# Altium schematic sheet 02_MCU.SchDoc: Temperature Logger
size A3; Organization: UnboxNbeyond; DocumentNumber: 2; Revision: A1; SheetNumber: 2; SheetTotal: 2
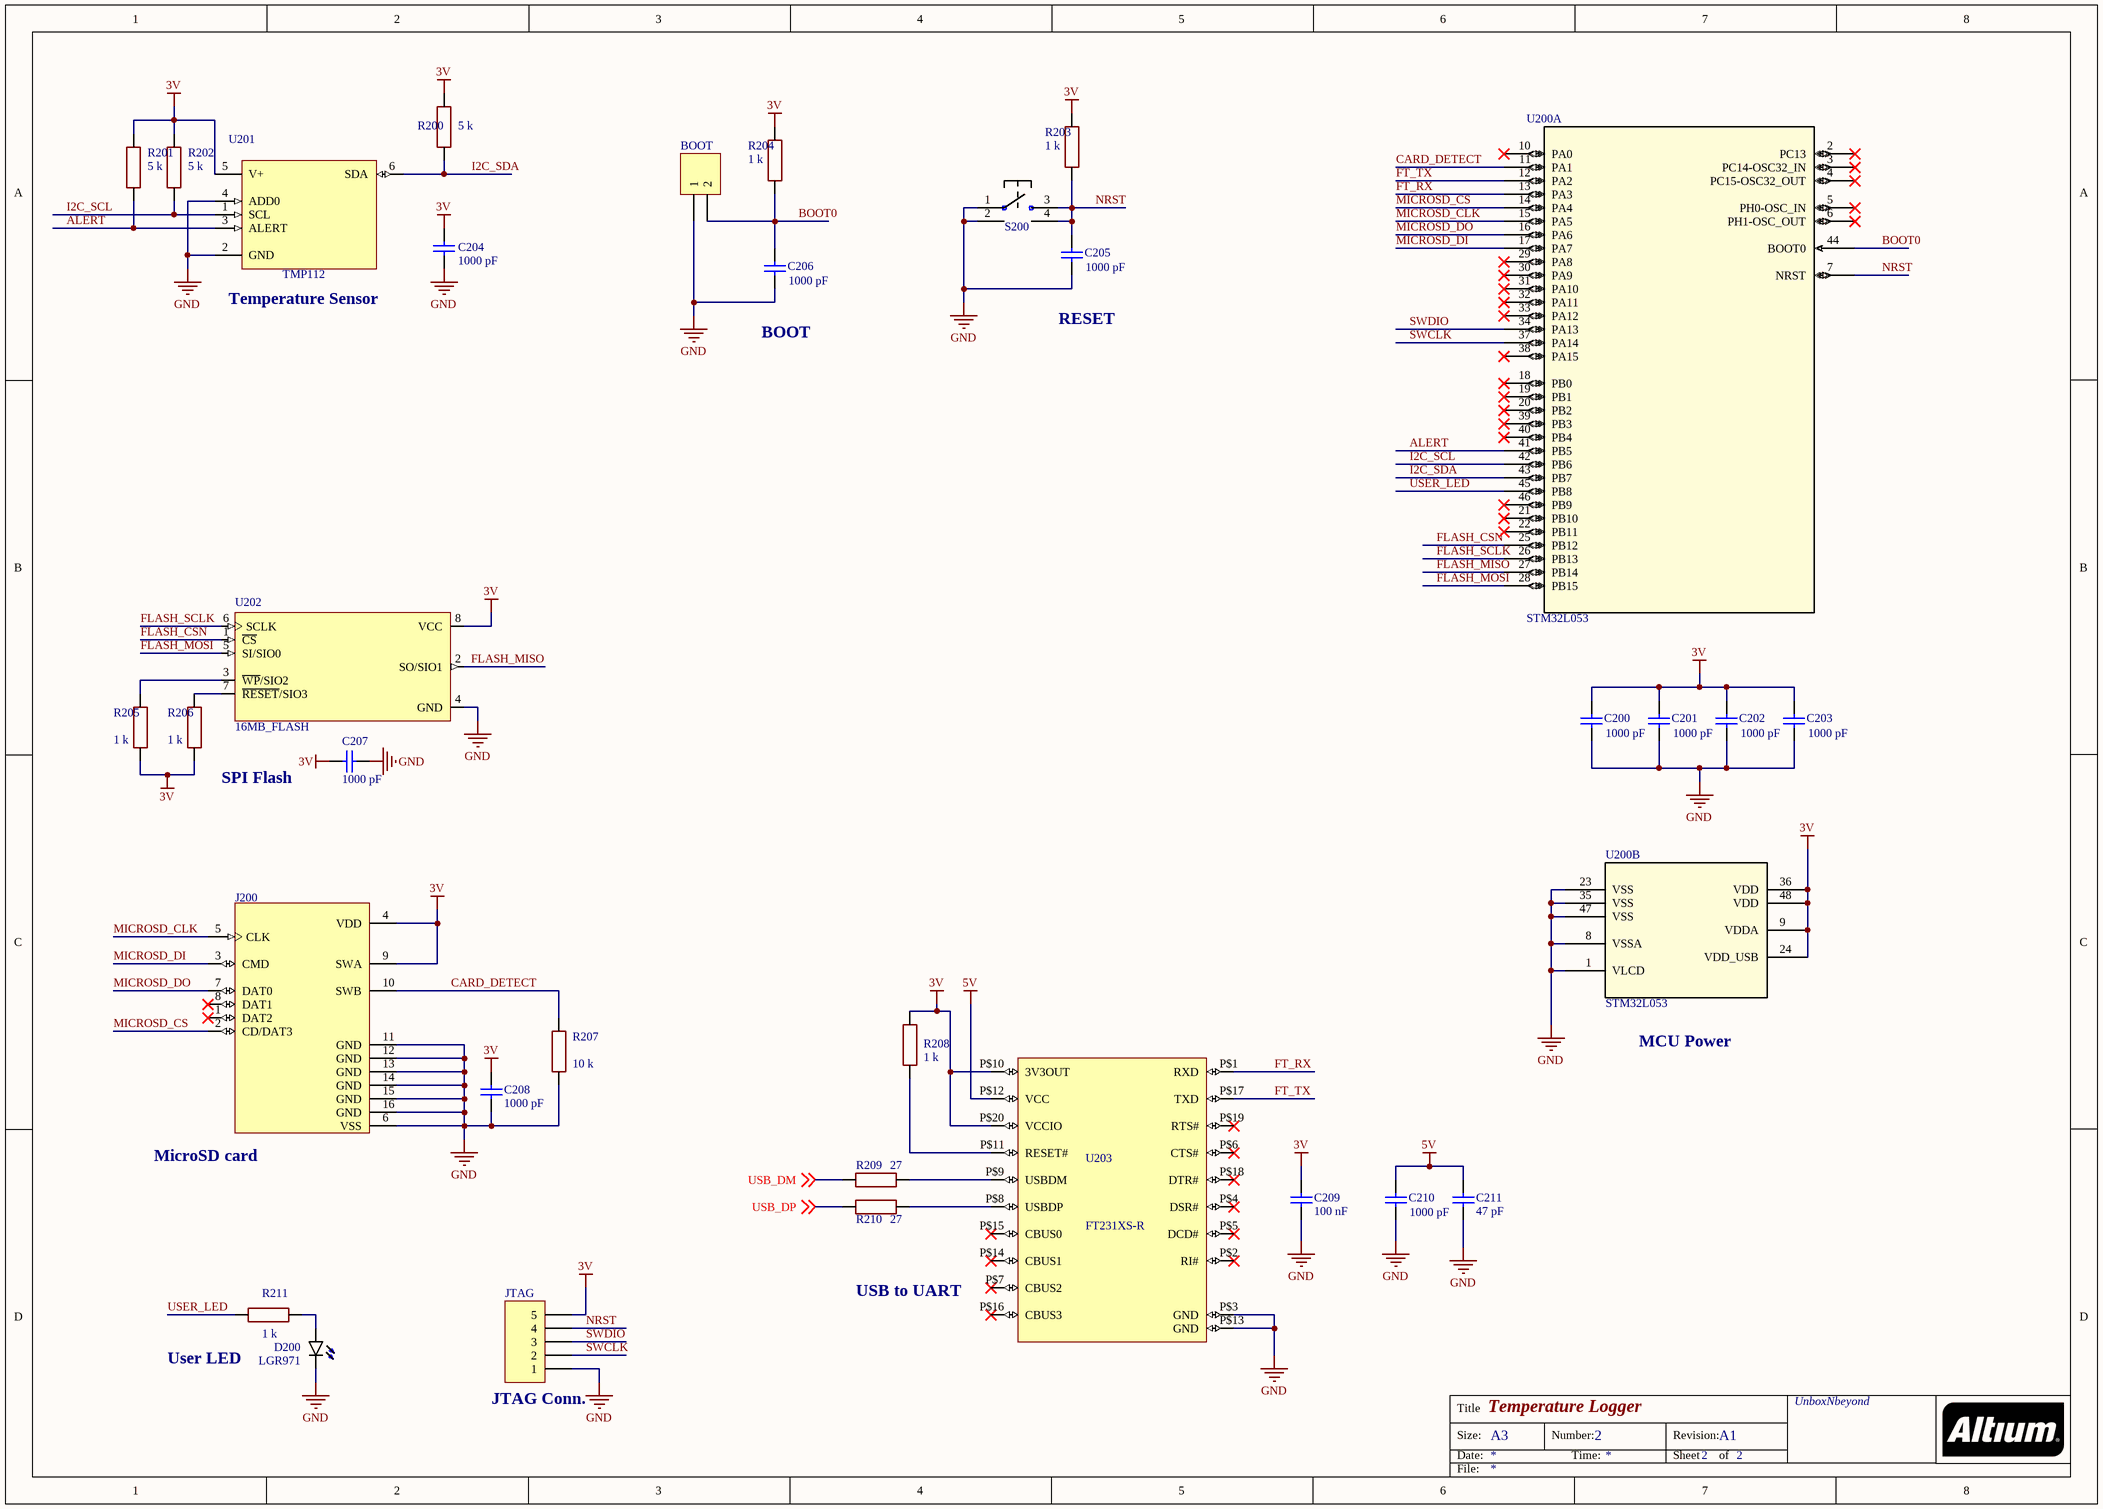
[diagram p0: 02_MCU.SchDoc]

## Parts
BOOT  (no value)  [HDR1X2]
C200  1000 pF  [C0805]
C201  1000 pF  [C0805]
C202  1000 pF  [C0805]
C203  1000 pF  [C0805]
C204  1000 pF  [C0805]
C205  1000 pF  [C0805]
C206  1000 pF  [C0805]
C207  1000 pF  [C0805]
C208  1000 pF  [C0805]
C209  100 nF  [C0805]
C210  1000 pF  [C0805]
C211  47 pF  [C0805]
D200  LGR971  [D0805]
J200  MicroSD  [MicroSD]  (value not drawn)
JTAG  (no value)  [HDR1X5]
R200  5 k  [R0805]
R201  5 k  [R0805]
R202  5 k  [R0805]
R203  1 k  [R0805]
R204  1 k  [R0805]
R205  1 k  [R0805]
R206  1 k  [R0805]
R207  10 k  [R0805]
R208  1 k  [R0805]
R209  27  [R0805]
R210  27  [R0805]
R211  1 k  [R0805]
S200  Switch_tactile  [Tactile1]  (value not drawn)
U200  STM32L053  [LQFP48-7x7mm]  (parts A,B of 2)
U201  TMP112  [SOT563]
U202  16MB_FLASH  [8-SOIC]
U203  FT231XS-R  [SSOP20]

## Nets
3V: C200.2 C201.2 C202.2 C203.2 C204.2 C207.2 C208.1 C209.2 J200.4(VDD) J200.9(SWA) JTAG.5 R200.1 R201.1 R202.1 R203.1 R204.1 R205.1 R206.1 R208.1 U200.9(VDDA) U200.24(VDD_USB) U200.36(VDD) U200.48(VDD) U201.5(V+) U202.8(VCC) U203.P$10(3V3OUT) U203.P$20(VCCIO)
5V: C210.2 C211.2 U203.P$12(VCC)
GND: BOOT.1 C200.1 C201.1 C202.1 C203.1 C204.1 C205.1 C206.1 C207.1 C208.2 C209.1 C210.1 C211.1 D200.C J200.6(VSS) J200.11(GND) J200.12(GND) J200.13(GND) J200.14(GND) J200.15(GND) J200.16(GND) JTAG.1 R207.2 S200.1(P$1) S200.2(P$1) U200.1(VLCD) U200.8(VSSA) U200.23(VSS) U200.35(VSS) U200.47(VSS) U201.2(GND) U201.4(ADD0) U202.4(GND) U203.P$3(GND) U203.P$13(GND)
ALERT: R201.2 U200.41(PB5) U201.3(ALERT)
BOOT0: BOOT.2 C206.2 R204.2 U200.44(BOOT0)
CARD_DETECT: J200.10(SWB) R207.1 U200.11(PA1)
FLASH_CSN: U200.25(PB12) U202.1(~{CS})
FLASH_MISO: U200.27(PB14) U202.2(SO/SIO1)
FLASH_MOSI: U200.28(PB15) U202.5(SI/SIO0)
FLASH_SCLK: U200.26(PB13) U202.6(SCLK)
FT_RX: U200.13(PA3) U203.P$1(RXD)
FT_TX: U200.12(PA2) U203.P$17(TXD)
I2C_SCL: R202.2 U200.42(PB6) U201.1(SCL)
I2C_SDA: R200.2 U200.43(PB7) U201.6(SDA)
MICROSD_CLK: J200.5(CLK) U200.15(PA5)
MICROSD_CS: J200.2(CD/DAT3) U200.14(PA4)
MICROSD_DI: J200.3(CMD) U200.17(PA7)
MICROSD_DO: J200.7(DAT0) U200.16(PA6)
NRST: C205.2 JTAG.4 R203.2 S200.3(P$2) S200.4(P$2) U200.7(NRST)
SWCLK: JTAG.2 U200.37(PA14)
SWDIO: JTAG.3 U200.34(PA13)
USB_DM: R209.2 ; off-sheet USB_DM
USB_DP: R210.2 ; off-sheet USB_DP
USER_LED: R211.2 U200.45(PB8)
NetD200_A: D200.A R211.1
NetR205_2: R205.2 U202.3(~{WP}/SIO2)
NetR206_2: R206.2 U202.7(~{RESET}/SIO3)
NetR208_2: R208.2 U203.P$11(RESET#)
NetR209_1: R209.1 U203.P$9(USBDM)
NetR210_1: R210.1 U203.P$8(USBDP)

Not connected (* = marked no-connect by the designer): J200 1(DAT2)* 8(DAT1)*; U200 2(PC13)* 3(PC14-OSC32_IN)* 4(PC15-OSC32_OUT)* 5(PH0-OSC_IN)* 6(PH1-OSC_OUT)* 10(PA0)* 18(PB0)* 19(PB1)* 20(PB2)* 21(PB10)* 22(PB11)* 29(PA8)* 30(PA9)* 31(PA10)* 32(PA11)* 33(PA12)* 38(PA15)* 39(PB3)* 40(PB4)* 46(PB9)*; U203 P$2(RI#)* P$4(DSR#)* P$5(DCD#)* P$6(CTS#)* P$7(CBUS2)* P$14(CBUS1)* P$15(CBUS0)* P$16(CBUS3)* P$18(DTR#)* P$19(RTS#)*

## Notes on the sheet
- (near U201) Temperature Sensor
- (near C206) BOOT
- (near C205) RESET
- SPI Flash
- MCU Power
- (near J200) MicroSD card
- USB to UART
- (near R211) User LED
- (near JTAG) JTAG Conn.
- Title
- Size:
- Date:
- A3
- Number:
- Time:
- Revision:
- Sheet
- of
- File:

## Library data of the parts
BOOT = Header 2: Header, 2-Pin; LatestRevisionDate: 17-Jul-2002; LatestRevisionNote: Re-released for DXP Platform.; Publisher: Altium Limited
C200-C208 C210 = Cap-1000pF: CAP CER 1000PF 100V X7R 0805; Manufacturer: KEMET; Manufacturer Part Number: C0805C102K1RACTU; Value: 1000 pF; Digikey_link: https://www.digikey.com.au/product-detail/en/kemet/C0805C102K1RACTU/399-1148-2-ND/411147; Package: C0805; Price: 0.035 USD
C209 = Cap-100nF: CAP CER 0.1UF 50V X7R 0805; Manufacturer: KEMET; Manufacturer Part Number: C0805X104K5RACTU; Digikey_link: https://www.digikey.com.au/product-detail/en/kemet/C0805X104K5RACTU/399-5330-1-ND/1842309; Package: C0805; Price: 0.46 AUD; Value: 100 nF
C211 = Cap-47pF: CAP CER 47PF 1KV C0G/NP0 0805; Manufacturer: KEMET; Manufacturer Part Number: C0805C470JDGACTU; Digikey_link: https://www.digikey.com.au/product-detail/en/kemet/C0805C470JDGACTU/399-7157-1-ND/3439404; Package: C0805; Price: 0.62 AUD; Value: 47 pF
D200 = LGR971: LED GREEN DIFFUSED 0805 SMD; Manufacturer: Osram Opto; Manufacturer Part Number: LG R971-KN-1; Value: Green LED; Price: 0.09 USD; Package: LED0805; Digikey_link: https://www.digikey.com.au/product-detail/en/osram-opto-semiconductors-inc/LG-R971-KN-1/475-1410-2-ND/1227925
J200 = MicroSD: MICRO SD PUSH PUSH LOW PROFILE TYPE; Manufacturer Part Number: 2201778-1; Manufacturer: TE Connectivity; Product_Type: Removable Memory Products; Price: 3.61 USD; Package: MicroSD; Value: MicroSD; Digikey_link: https://www.digikey.com.au/product-detail/en/te-connectivity-amp-connectors/2201778-1/A118117CT-ND/4729820
JTAG = Header 5: Header, 5-Pin; LatestRevisionDate: 17-Jul-2002; LatestRevisionNote: Re-released for DXP Platform.; Publisher: Altium Limited
R200-R202 = Res-5k: RES SMD 4.7K OHM 0.1% 1/8W 0805; Manufacturer: Panasonic Electronic Components; Manufacturer Part Number: ERA-6AEB472V; Value: 5k; Package: R0805; Price: 0.51 AUD; Digikey_link: https://www.digikey.com.au/product-detail/en/panasonic-electronic-components/ERA-6AEB472V/P4.7KDACT-ND/1465963
R203-R206 R208 R211 = Res-1k: RES 1K OHM 0.1% 1/5W 0805; Manufacturer: Vishay Dale; Manufacturer Part Number: TNPW08051K00BEEA; Package: R0805; Price: 0.03 USD; Value: 1k; Digikey_link: https://www.digikey.com.au/product-detail/en/vishay-dale/TNPW08051K00BEEA/TNP1.00KABTR-ND/1607282
R207 = Res-10k: RES SMD 10K OHM 0.1% 1/8W 0805; Manufacturer: Panasonic Electronic Components; Manufacturer Part Number: ERA-6AEB103V; Package: R0805; Price: 0.36 AUD; Digikey_link: https://www.digikey.com/product-detail/en/panasonic-electronic-components/ERA-6AEB103V/P10KDACT-ND/1465971; Value: 10k
R209 R210 = Res-27: RES SMD 27 OHM 5% 1/8W 0805; Manufacturer: Panasonic Electronic Components; Manufacturer Part Number: ERJ-6GEYJ270V; Package: R0805; Price: 0.11 AUD; Digikey_link: https://www.digikey.com.au/product-detail/en/panasonic-electronic-components/ERJ-6GEYJ270V/P27ACT-ND/42810; Value: 27
S200 = Switch_tactile: SWITCH TACTILE SPST-NO 0.05A 12V; Manufacturer: C&K Components; Manufacturer Part Number: PTS645SM43SMTR; Package: 6x6; Price: 0.22 USD; Value: Switch_Tactile; Digikey_link: https://www.digikey.com.au/product-detail/en/c-k/PTS645SM43SMTR92-LFS/CKN9112CT-ND/1146934
U200 = STM32L0x3CL4: IC MCU 32BIT 64KB FLASH 48LQFP; Manufacturer: STMicroelectronics; Value: STM32L053C8T6; Manufacturer Part Number: STM32L053C8T6; Package: 48LQFP; Price: 5.66 AUD; Digikey_link: https://www.digikey.com.au/product-detail/en/stmicroelectronics/STM32L053C8T6/497-14906-ND/4935255
U201 = TMP112AIDRLT: 1.4V-Capable ?0.5?C Temperature Sensor with Alert Function and I2C/SMBus interface in SOT-563 6-SOT -40 to 125; Manufacturer: Texas Instruments; Manufacturer Part Number: TMP112AIDRLT; Digikey_link: https://www.digikey.com/product-detail/en/texas-instruments/TMP112AIDRLR/296-38578-2-ND/2232593; Package: SOT-563; Price: 1 USD; Value: TMP112AIDRLT
U202 = MX25R1635: IC FLASH 16M SPI 80MHZ 8SOP; Manufacturer Part Number: MX25R1635FM2IL0; Manufacturer: Macronix; Value: MX25R1635FM2IH1; Package: SOP-8; Digikey_link: https://www.digikey.com/product-detail/en/macronix/MX25R1635FM2IH1/1092-1176-ND/5957737; Price: 0.97 USD
U203 = FT231XS-R: USB Full Speed to Full Handshake UART with USB Charger Detection; MF: FTDI,; MP: FT231XS-R; Availability: Good; SnapEDA_Link: https://www.snapeda.com/parts/FT231XS-R/FTDI%2C%20Future%20Technology%20Devices%20International%20Ltd/view-part/?ref=snap; Package: SSOP-20 FTDI; Price: 1.80 USD; Value: *